# Altium schematic sheet Sheet3.SchDoc
size A4
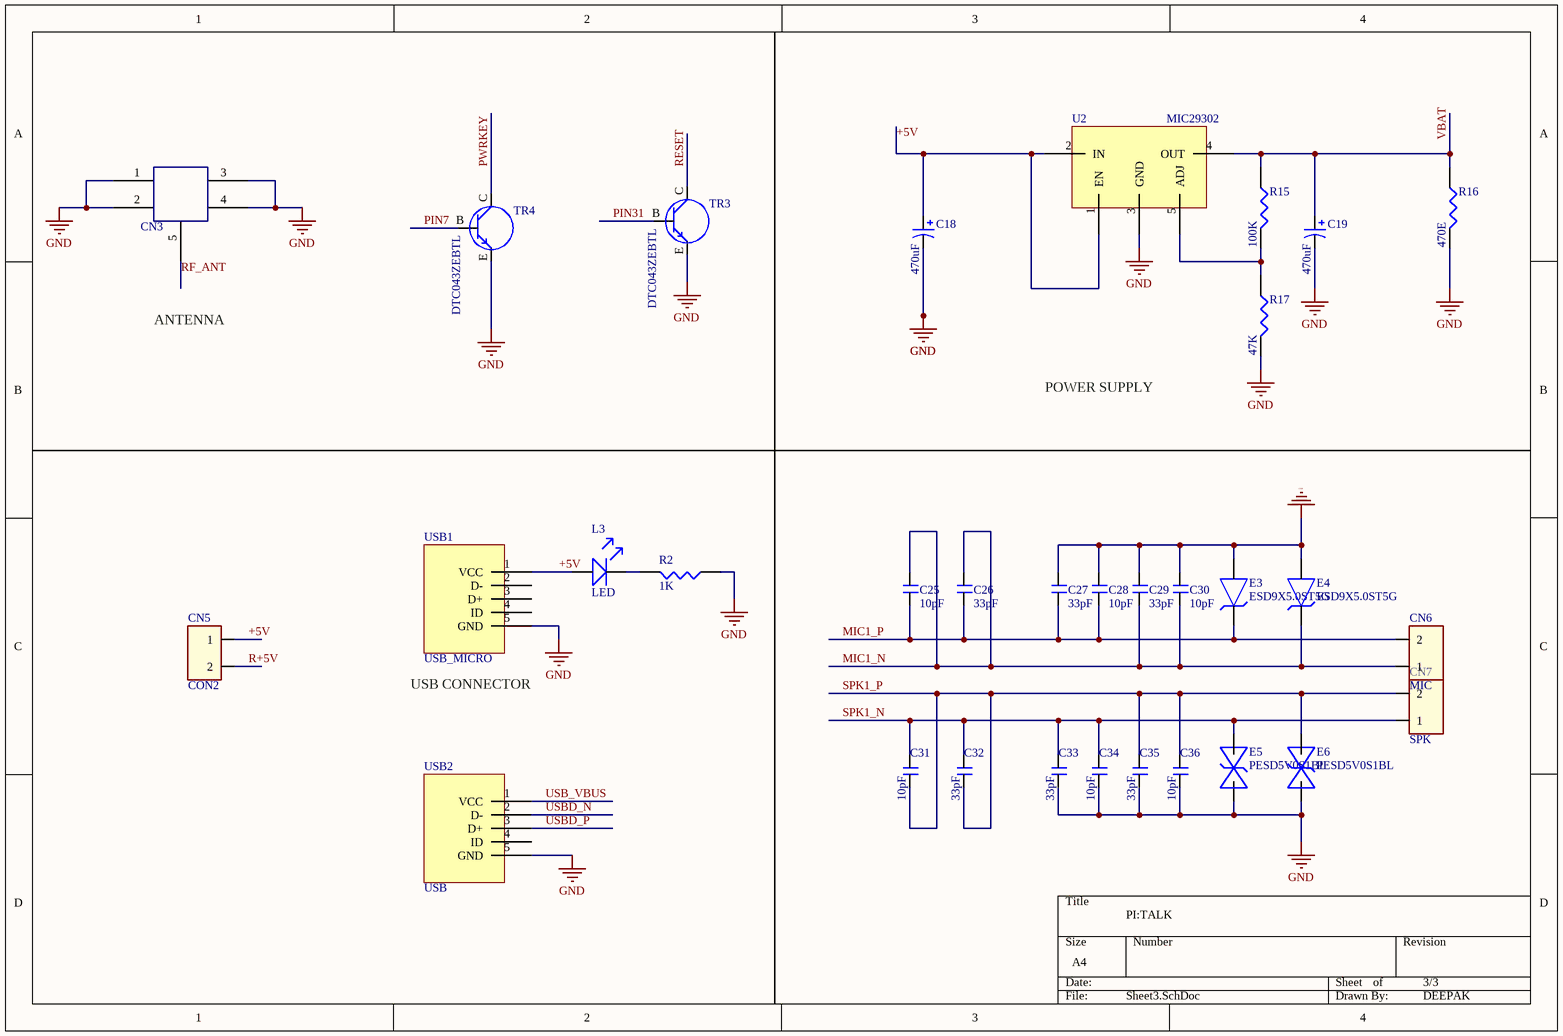
[diagram p0: Sheet3.SchDoc]

## Parts
C18  470uF  [Cap_Tantalum C-CASE_AVX]
C19  470uF  [Cap_Tantalum C-CASE_AVX]
C25  10pF  [CAP_0603_NONPOLAR]
C26  33pF  [CAP_0603_NONPOLAR]
C27  33pF  [CAP_0603_NONPOLAR]
C28  10pF  [CAP_0603_NONPOLAR]
C29  33pF  [CAP_0603_NONPOLAR]
C30  10pF  [CAP_0603_NONPOLAR]
C31  10pF  [CAP_0603_NONPOLAR]
C32  33pF  [CAP_0603_NONPOLAR]
C33  33pF  [CAP_0603_NONPOLAR]
C34  10pF  [CAP_0603_NONPOLAR]
C35  33pF  [CAP_0603_NONPOLAR]
C36  10pF  [CAP_0603_NONPOLAR]
CN3  SMA  CONNECTOR  [SMA_CONNECTOR]  (value not drawn)
CN5  CON2  [CON2_BJ]
CN6  MIC  [CON2_BJ]
CN7  SPK  [CON2_BJ]
E3  ESD9X5.0ST5G  [SOD923]
E4  ESD9X5.0ST5G  [SOD923]
E5  PESD5V0S1BL  [SOD882]
E6  PESD5V0S1BL  [SOD882]
L3  LED  [LED_0603_neg]
R2  1K  [0603]
R15  100K  [0603]
R16  470E  [0603]
R17  47K  [0603]
TR3  DTC043ZEBTL  [DTC043ZEBTL]
TR4  DTC043ZEBTL  [DTC043ZEBTL]
U2  MIC29302  [MIC29302]
USB1  USB_MICRO  [USB_MICRO]
USB2  USB  [USB_MICRO]

## Nets
GND: C18.K C19.K C27.1 C28.1 C29.1 C30.1 C33.1 C34.1 C35.1 C36.1 CN3.1 CN3.2 CN3.3 CN3.4 E3.2(A) E4.2(A) E5.1(C) E6.1(C) R2.1 R16.2 R17.2 TR3.E TR4.E U2.3(GND) USB1.5(GND) USB2.5(GND)
+5V: C18.A CN5.1 L3.A U2.1(EN) U2.2(IN) USB1.1(VCC)
MIC1_N: C25.1 C26.1 C29.2 C30.2 CN6.1 E4.1(C)
MIC1_P: C25.2 C26.2 C27.2 C28.2 CN6.2 E3.1(C)
PIN7: TR4.B
PIN31: TR3.B
PWRKEY: TR4.C
R+5V: CN5.2
RESET: TR3.C
RF_ANT: CN3.5
SPK1_N: C31.2 C32.2 C33.2 C34.2 CN7.1 E5.2(A)
SPK1_P: C31.1 C32.1 C35.2 C36.2 CN7.2 E6.2(A)
USB_VBUS: USB2.1(VCC)
USBD_N: USB2.2(D-)
USBD_P: USB2.3(D+)
VBAT: C19.A R15.1 R16.1 U2.4(OUT)
NetL3_K: L3.K R2.2
NetR15_2: R15.2 R17.1 U2.5(ADJ)

Not connected (* = marked no-connect by the designer): USB1 2(D-) 3(D+) 4(ID); USB2 4(ID)

## Notes on the sheet
- ANTENNA
- POWER SUPPLY
- (near USB1) USB CONNECTOR
- PI:TALK
- 3/3
- DEEPAK

## Library data of the parts
C18 C19 = CAP_ELEC
C25-C36 = CAP_NONPOLAR
CN3 = SMA CONNECTOR
CN6 CN7 = CON2
R2 R15-R17 = RES
USB2 = USB_MICRO